# EAGLE design m1k-buffermod-s2 (EAGLE 7.7.0)
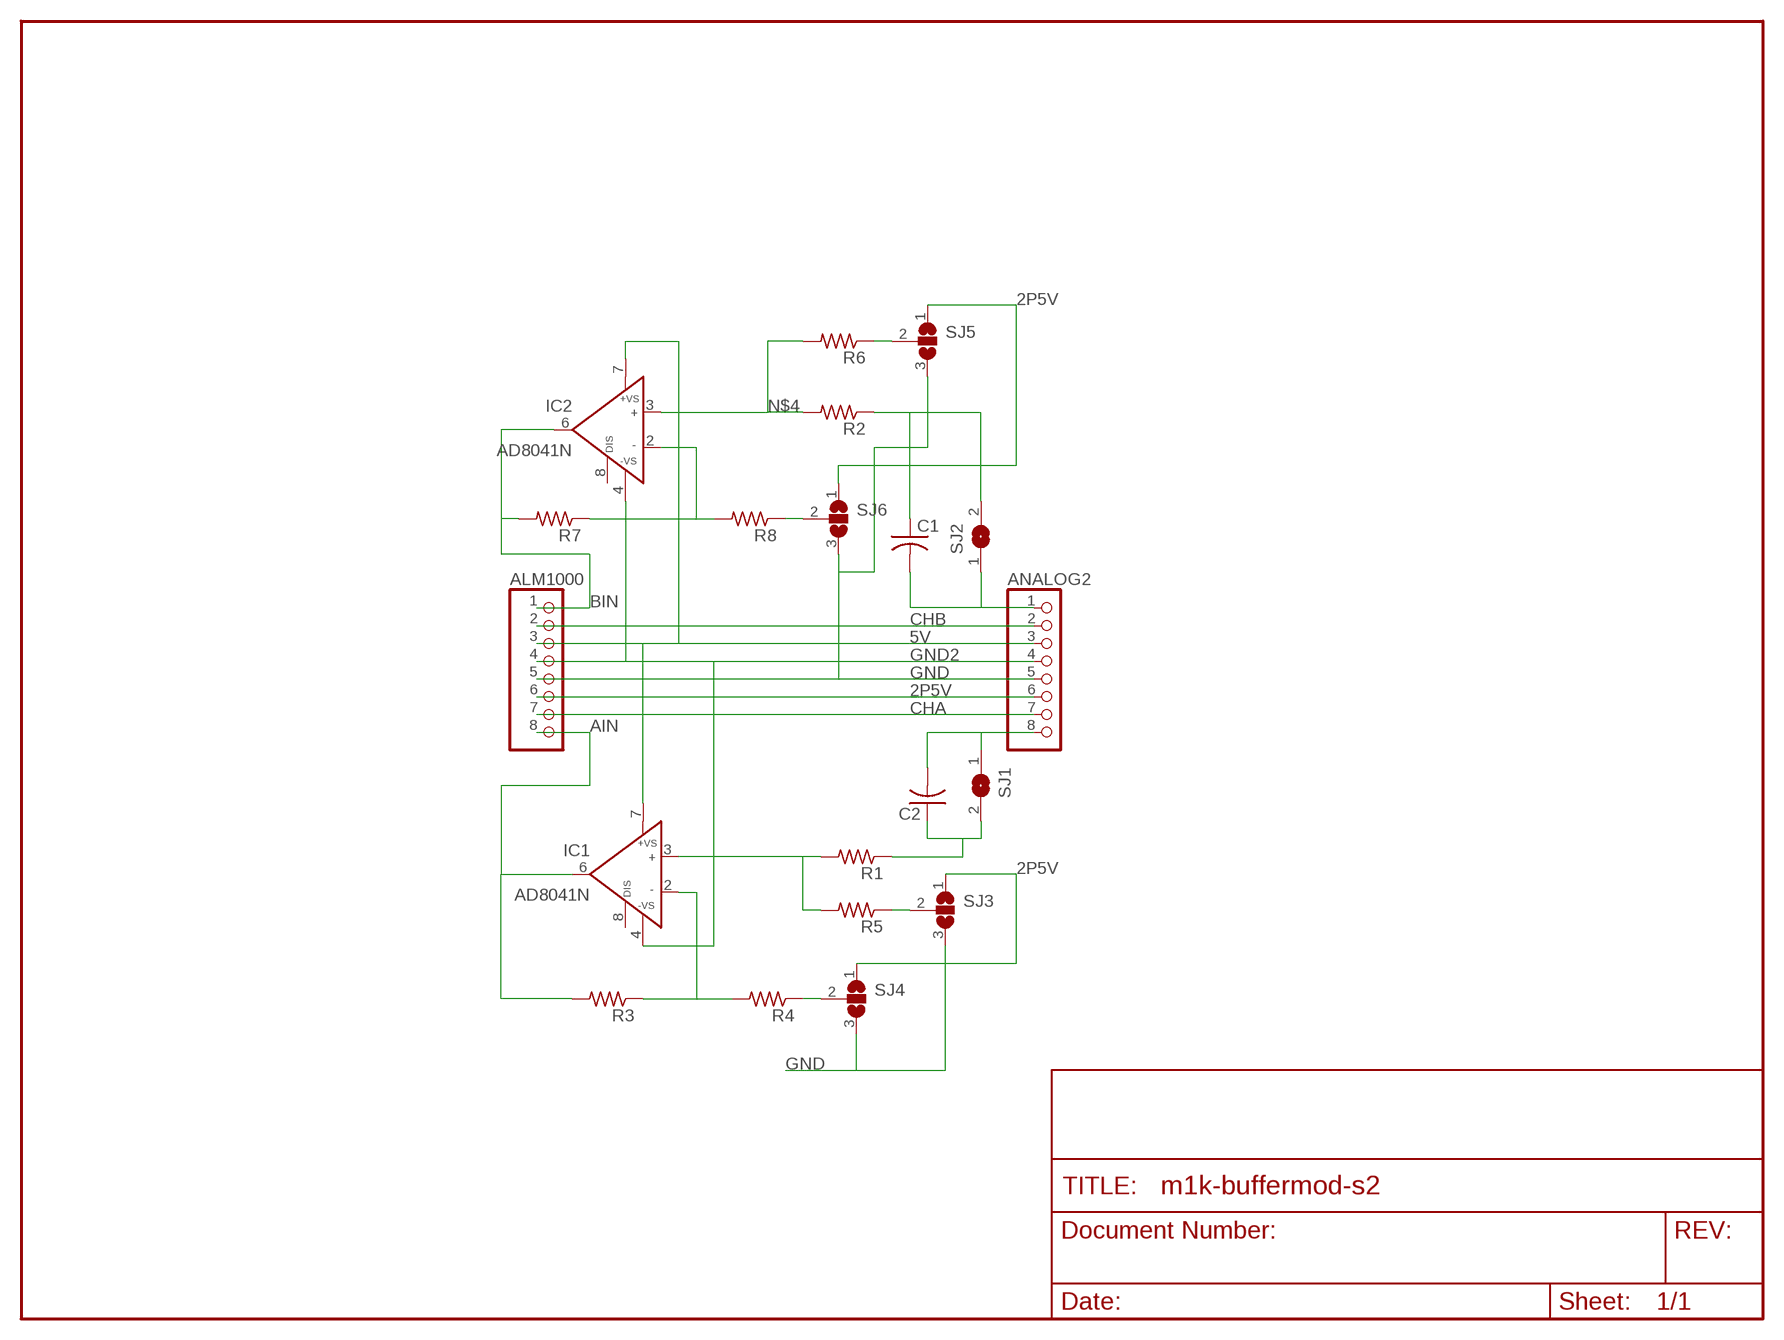
[diagram p0: schematic, sheet 1]

## Parts
ALM1000  PINHD-1X8  [1X08]
ANALOG2  PINHD-1X8  [1X08]
C1  C-US050-024X044  [C050-024X044]
C2  C-US050-024X044  [C050-024X044]
IC1  AD8041N  [DIL08]
IC2  AD8041N  [DIL08]
R1  R-US_0204/7  [0204/7]
R2  R-US_0204/7  [0204/7]
R3  R-US_0204/7  [0204/7]
R4  R-US_0204/7  [0204/7]
R5  R-US_0204/7  [0204/7]
R6  R-US_0204/7  [0204/7]
R7  R-US_0204/7  [0204/7]
R8  R-US_0204/7  [0204/7]
SJ1  SJ  [SJ]
SJ2  SJ  [SJ]
SJ3  SJ2W  [SJ_2]
SJ4  SJ2W  [SJ_2]
SJ5  SJ2W  [SJ_2]
SJ6  SJ2W  [SJ_2]

## Nets
2P5V: ALM1000.6 ANALOG2.6 SJ3.1 SJ4.1 SJ5.1 SJ6.1
5V: ALM1000.3 ANALOG2.3 IC1.7(+VS) IC2.7(+VS)
AIN: ALM1000.8 IC1.6(OUT) R3.2
BIN: ALM1000.1 IC2.6(OUT) R7.2
CHA: ALM1000.7 ANALOG2.7
CHB: ALM1000.2 ANALOG2.2
GND: ALM1000.5 ANALOG2.5 SJ3.3 SJ4.3 SJ5.3 SJ6.3
GND2: ALM1000.4 ANALOG2.4 IC1.4(-VS) IC2.4(-VS)
N$1: ANALOG2.1 C1.2 SJ2.1
N$2: IC1.2(IN-) R3.1 R4.2
N$3: ANALOG2.8 C2.2 SJ1.1
N$4: IC2.3(IN+) R2.2 R6.2
N$5: C2.1 R1.1 SJ1.2
N$6: C1.1 R2.1 SJ2.2
N$7: R4.1 SJ4.2
N$8: R5.1 SJ3.2
N$11: IC2.2(IN-) R7.1 R8.2
N$12: R6.1 SJ5.2
N$13: IC1.3(IN+) R1.2 R5.2
N$14: R8.1 SJ6.2
Unconnected: IC1.8(DISABLE) IC2.8(DISABLE)

## Library data of the parts
ALM1000 ANALOG2 = pinhead:PINHD-1X8: PIN HEADER
C1 C2 = rcl:C-US: CAPACITOR, American symbol
IC1 IC2 = analog-devices:AD8041: 160 MHz Rail-to-Rail Amplifier with Disable Source: http://www.analog.com/static/imported-files/data_sheets/AD8041.pdf; MPN: AD8041ANZ; OC_FARNELL: 1438577; OC_NEWARK: 15P0923
R1-R8 = resistor:R-US_: RESISTOR, American symbol
SJ1 SJ2 = jumper:SJ: SMD solder JUMPER
SJ3-SJ6 = jumper:SJ2W: SMD solder JUMPER

## Board
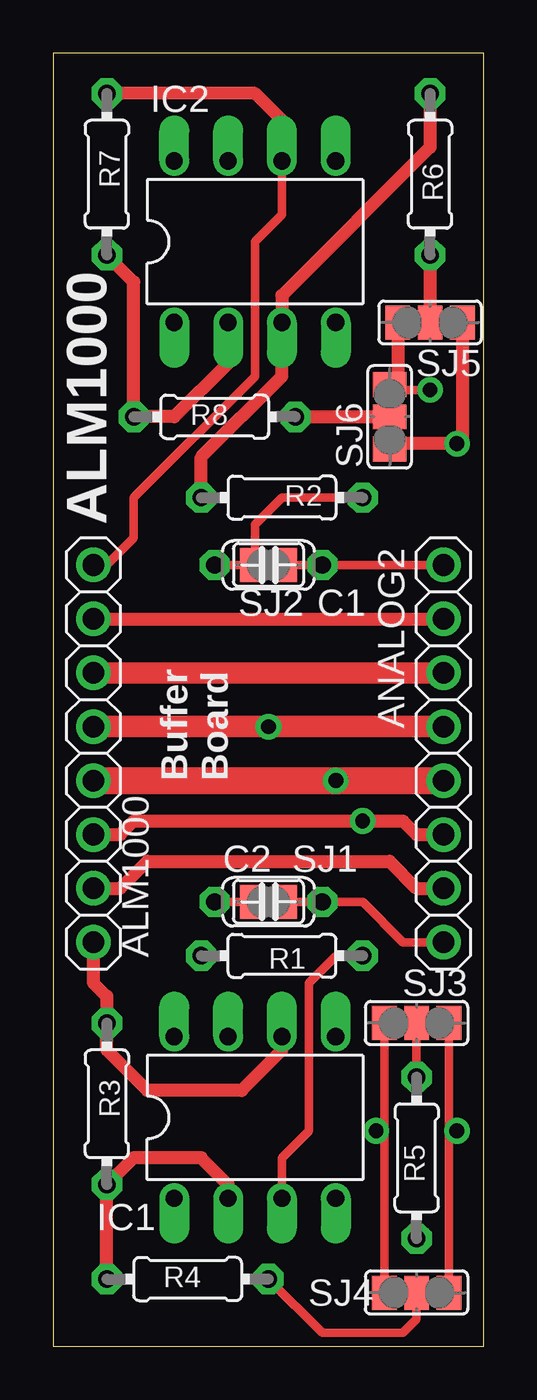
[diagram p1: board, top side]
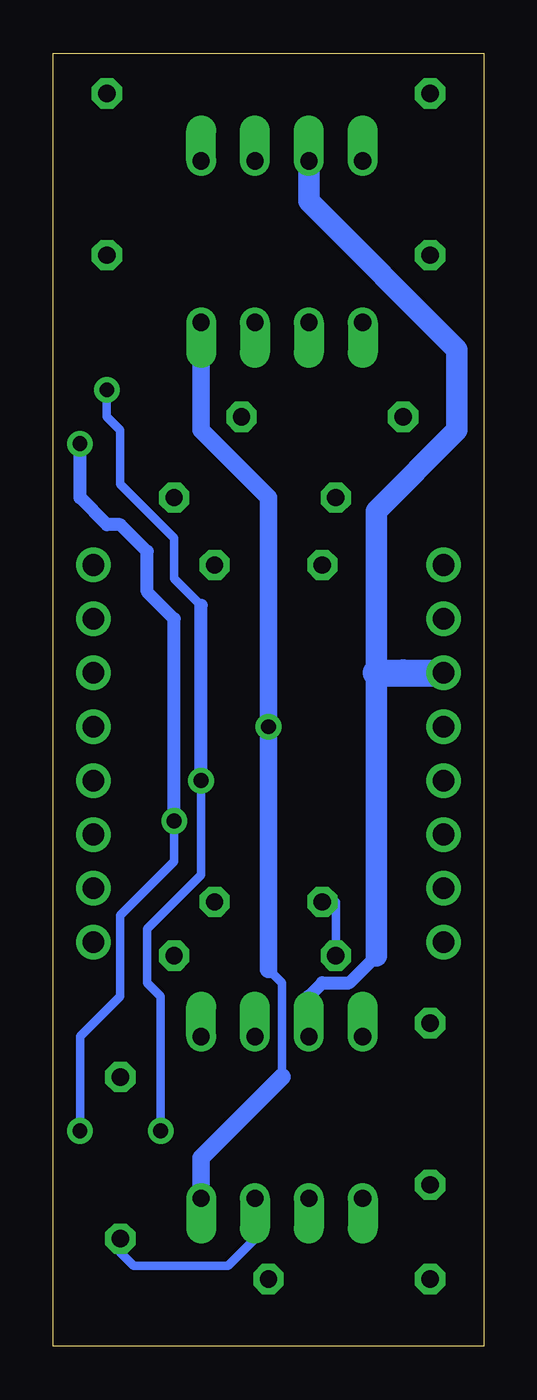
[diagram p2: board, bottom side, seen from below]

Size 20.32 x 60.96 mm. Coordinates in mm from the lower left corner, seen from the top.
Outline: 20.32,0 20.32,60.96 0,60.96 0,0 20.32,0
Copper layers (1*16): Top 0.035mm / dielectric 1.5mm / Bottom 0.035mm
Design rules "default": minimum track width 8mil, minimum drill 20mil, track to track 8mil, track to pad 8mil, pad to pad 8mil, via to via 8mil, smd to smd 8mil, copper to edge 8mil, drill to drill 8mil, minimum pad ring 12mil, minimum via ring 10mil, stop-mask expansion 4mil, vias tented up to drill 20mil, thermal gap 10mil

### Footprints (pad centres in the part's own frame; a part is rotated, then mirrored left to right if it is on the bottom)
1X08 = drill 1.016: 1 -8.89,0; 2 -6.35,0; 3 -3.81,0; 4 -1.27,0; 5 1.27,0; 6 3.81,0; 7 6.35,0; 8 8.89,0
C050-024X044 = drill 0.813 octagon: 1 -2.54,0; 2 2.54,0
DIL08 = drill 0.813 offset: 1 -3.81,-3.81; 2 -1.27,-3.81; 3 1.27,-3.81; 4 3.81,-3.81; 5 3.81,3.81; 6 1.27,3.81; 7 -1.27,3.81; 8 -3.81,3.81
0204/7 = drill 0.813 octagon: 1 -3.81,0; 2 3.81,0
SJ = smd 1.168 x 1.6: 1 -0.762,0; 2 0.762,0
SJ_2 = smd 1.168 x 1.6: 1 -1.524,0; 2 0,0; 3 1.524,0

### Placement (x,y rotation side)
ALM1000  1.91,27.94 270 top
ANALOG2  18.41,27.94 270 top
C1  10.16,36.83 0 top
C2  10.16,20.95 0 top
IC1  9.53,10.79 0 top
IC2  9.53,52.07 0 top
R1  10.79,18.41 0 top
R2  10.79,40.01 180 top
R3  2.54,11.43 90 top
R4  6.35,3.17 180 top
R5  17.14,8.89 270 top
R6  17.78,55.24 90 top
R7  2.54,55.24 90 top
R8  7.62,43.81 180 top
SJ1  10.16,20.95 180 top
SJ2  10.16,36.83 180 top
SJ3  17.14,15.24 180 top
SJ4  17.14,2.54 180 top
SJ5  17.78,48.26 180 top
SJ6  15.88,43.81 90 top

### Tracks (layer width: path | path; a pad name or v marks a point on that pad's centre or on a via)
2P5V  (via drill 0.7)
  Top 0.406: SJ3.1 18.67,10.16 | 18.67,10.16 SJ4.1 | v19.05,10.16 18.67,10.16
  Top 0.61: ALM1000.6 3.17,24.13 3.81,24.77 v14.61,24.77 16.51,24.77 17.14,24.13 ANALOG2.6 | SJ5.1 19.3,42.8 v19.05,42.55 16.13,42.55 SJ6.1
  Bottom 0.406: v14.61,24.77 14.61,22.86 17.14,20.32 17.14,16.51 19.05,14.61 v19.05,10.16
  Bottom 0.61: v14.61,24.77 14.61,34.29 15.88,35.56 15.88,37.47 17.14,38.73 17.78,38.73 19.05,40.01 v19.05,42.55
5V
  Top 1.016: ALM1000.3 ANALOG2.3
  Bottom 0.61: IC1.7 8.26,16.51 7.62,17.14 6.35,17.14 5.08,18.41
  Bottom 1.016: IC2.7 8.26,53.98 1.27,46.99 1.27,43.18 5.08,39.37 5.08,31.75 5.08,18.41
  Bottom 1.27: 5.08,31.75 3.81,31.75 ALM1000.3
AIN
  Top 0.61: IC1.6 10.79,13.97 8.89,12.06 4.45,12.06 2.54,13.97 R3.2 2.54,16.51 1.91,17.14 ALM1000.8
BIN
  Top 0.406: IC2.6 10.79,53.34 9.53,52.07 9.53,45.72 3.81,40.01 3.81,38.1 2.54,36.83 ALM1000.1
  Top 0.61: IC2.6 10.79,57.78 9.53,59.05 R7.2
CHA
  Top 0.61: ALM1000.7 3.17,21.59 4.45,22.86 15.88,22.86 17.14,21.59 ANALOG2.7
CHB
  Top 0.61: ALM1000.2 ANALOG2.2
GND  (via drill 0.7)
  Top 0.406: v17.78,45.09 16.13,45.09 SJ6.3 | SJ3.3 15.62,10.16 | 15.62,10.16 SJ4.3 | v15.24,10.16 15.62,10.16
  Top 0.61: SJ5.3 16.26,45.72 SJ6.3
  Top 1.27: ALM1000.5 v13.34,26.67 ANALOG2.5
  Bottom 0.406: 13.34,34.92 14.61,36.2 14.61,38.1 17.14,40.64 17.14,43.18 17.78,43.81 v17.78,45.09 | v13.34,26.67 13.34,22.23 15.88,19.68 15.88,17.14 15.24,16.51 v15.24,10.16
  Bottom 0.61: v13.34,26.67 13.34,34.92
GND2  (via drill 0.7)
  Top 1.016: ALM1000.4 v10.16,29.21 ANALOG2.4
  Bottom 0.406: 9.53,12.7 9.53,17.14 10.16,17.78
  Bottom 0.813: IC2.4 13.34,43.18 10.16,40.01 v10.16,29.21 10.16,17.78 | IC1.4 13.34,8.89 9.53,12.7
N$1
  Top 0.406: ANALOG2.1 C1.2 SJ2.1
N$2
  Top 0.61: IC1.2 8.26,7.62 6.99,8.89 3.81,8.89 R3.1 R4.2
N$3
  Top 0.406: ANALOG2.8 16.51,19.05 14.61,20.95 C2.2 SJ1.1
N$4
  Top 0.61: R2.2 6.99,41.91 10.79,45.72 IC2.3 10.79,49.53 17.78,56.52 R6.2
N$5
  Top 0.406: SJ1.2 C2.1
  Bottom 0.406: R1.1 6.99,20.95 C2.1
N$6
  Top 0.406: R2.1 10.79,40.01 9.53,38.73 9.53,36.96 SJ2.2 C1.1
N$7
  Top 0.406: SJ4.2 17.14,1.27 16.51,0.64 12.7,0.64 R4.1
N$8
  Top 0.406: R5.1 SJ3.2
N$11
  Top 0.61: R7.1 3.81,50.16 R8.2 5.71,43.81 8.26,46.35 IC2.2
N$12
  Top 0.61: R6.1 SJ5.2
N$13
  Top 0.406: IC1.3 10.79,8.89 12.06,10.16 12.06,17.14 13.34,18.41 R1.2
  Bottom 0.406: R5.2 17.14,4.45 16.51,3.81 12.06,3.81 10.79,5.08 IC1.3
N$14
  Top 0.61: R8.1 SJ6.2

### Text on the board
tPlace: ALM1000 | Buffer / Board